# Altium project Final_20230913.PrjPcb
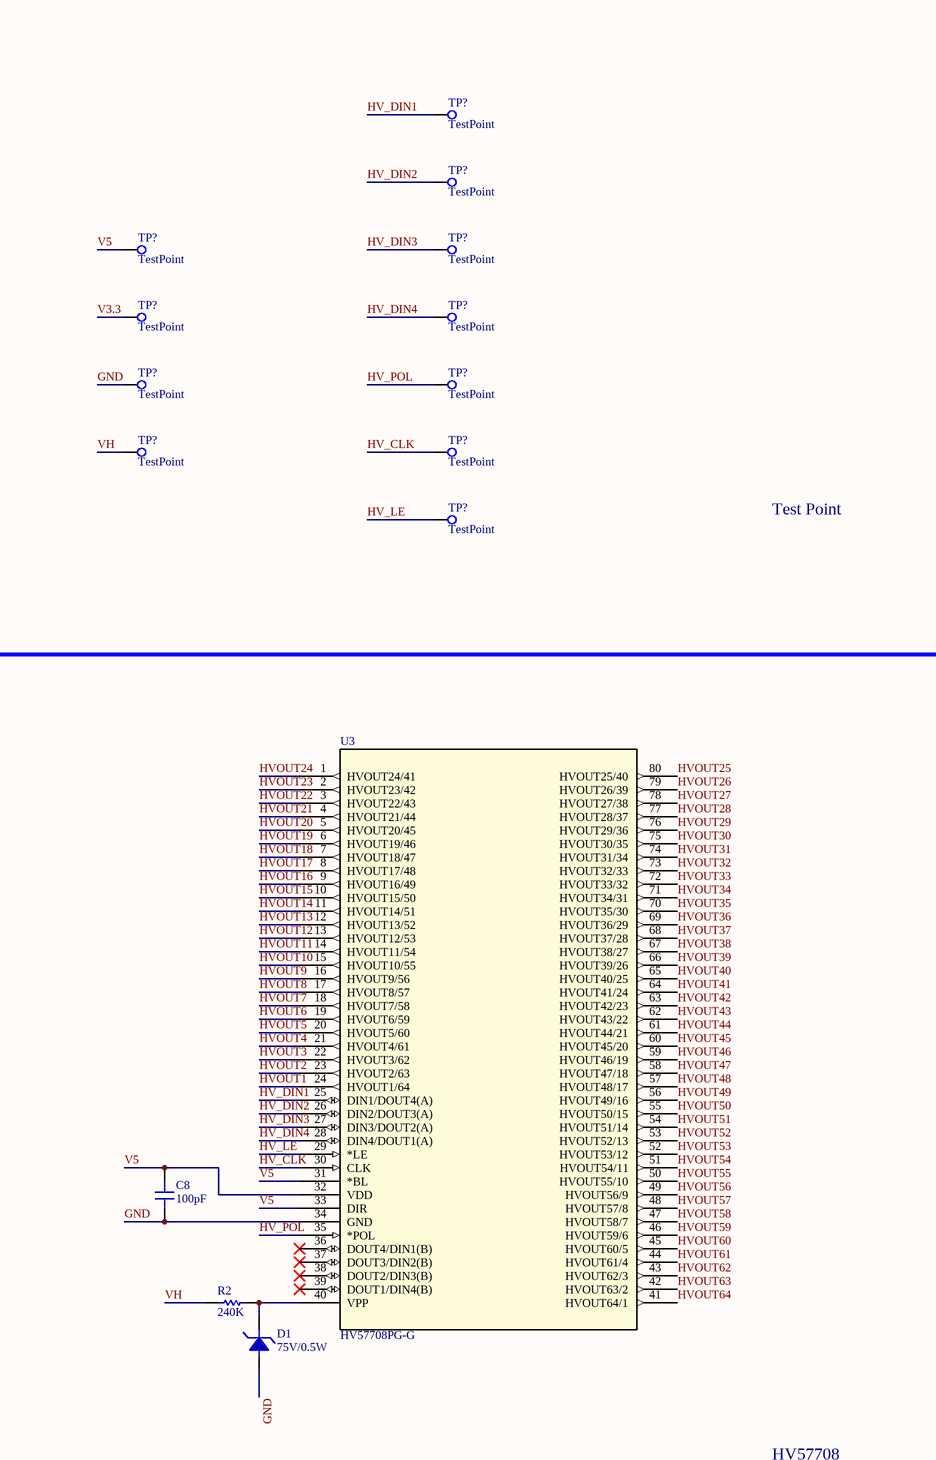
[diagram p0: Sch.SchDoc, top left]
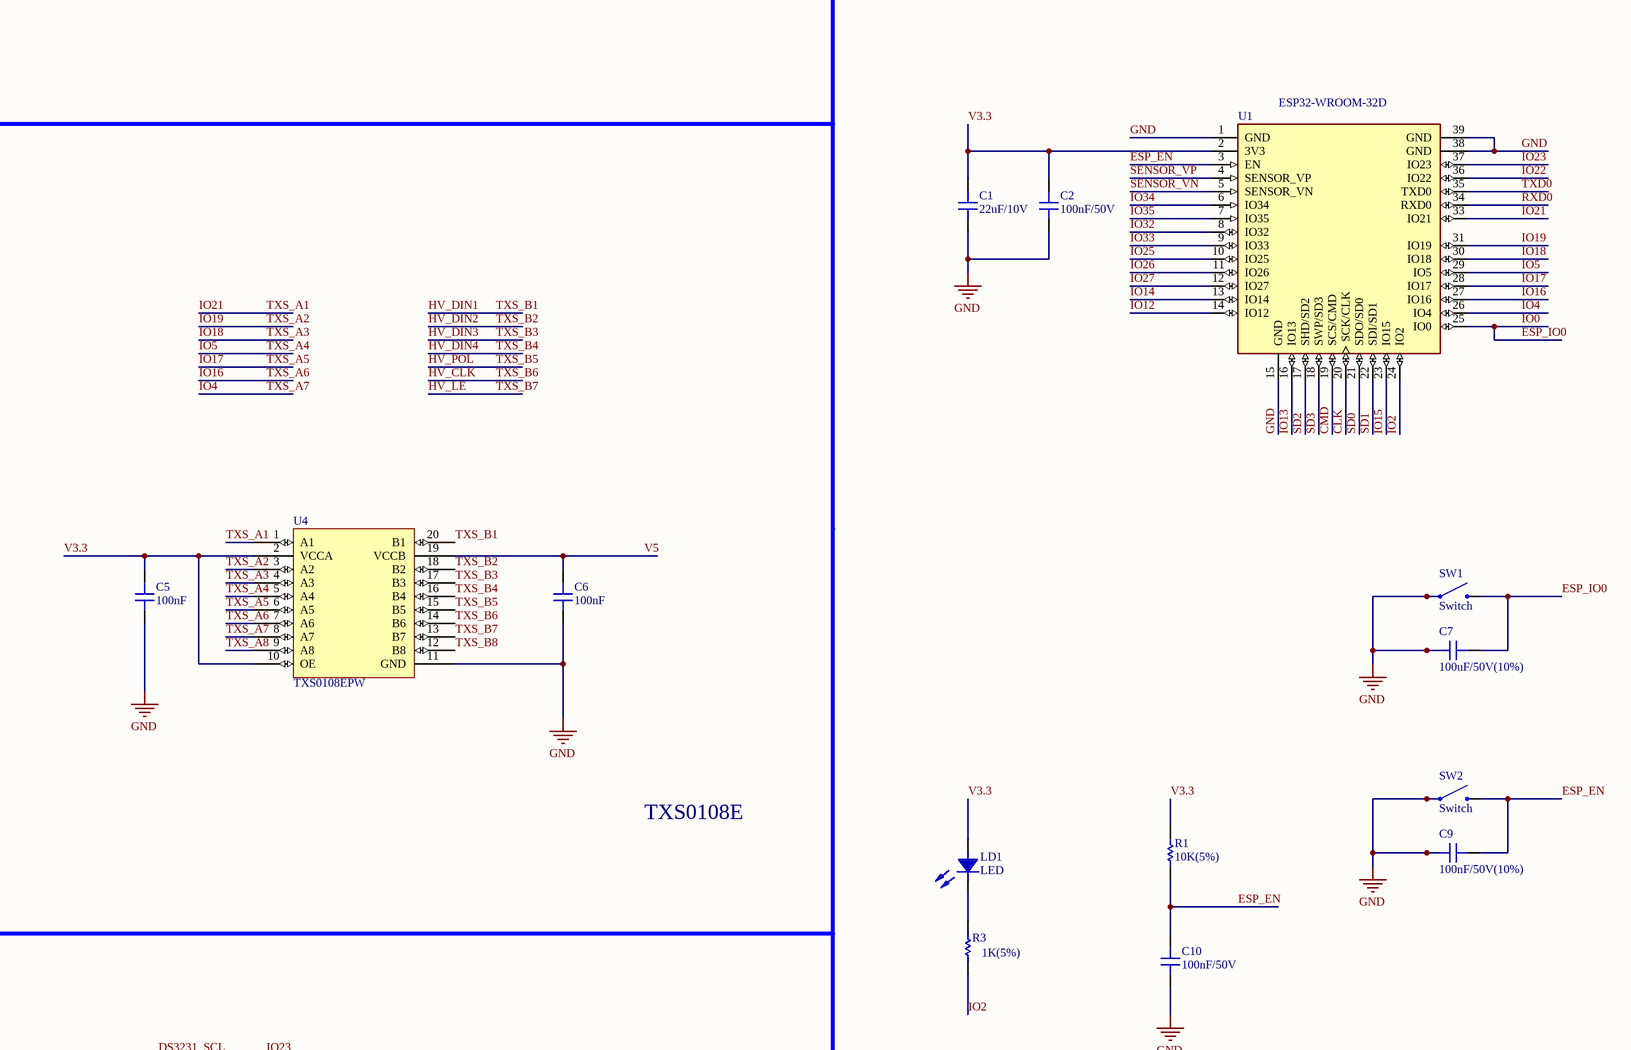
[diagram p1: Sch.SchDoc, top middle]
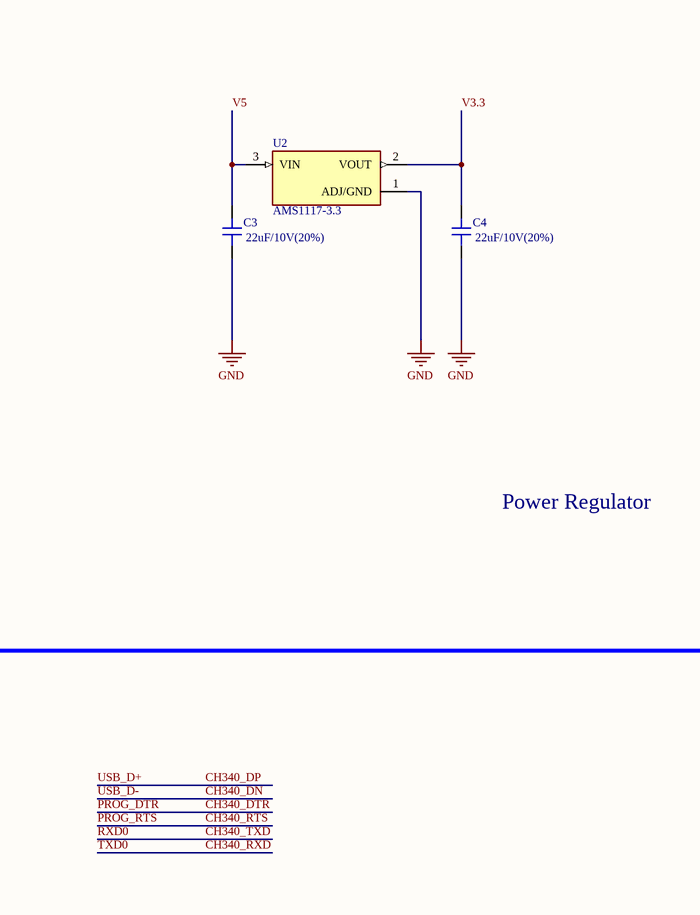
[diagram p2: Sch.SchDoc, top right]
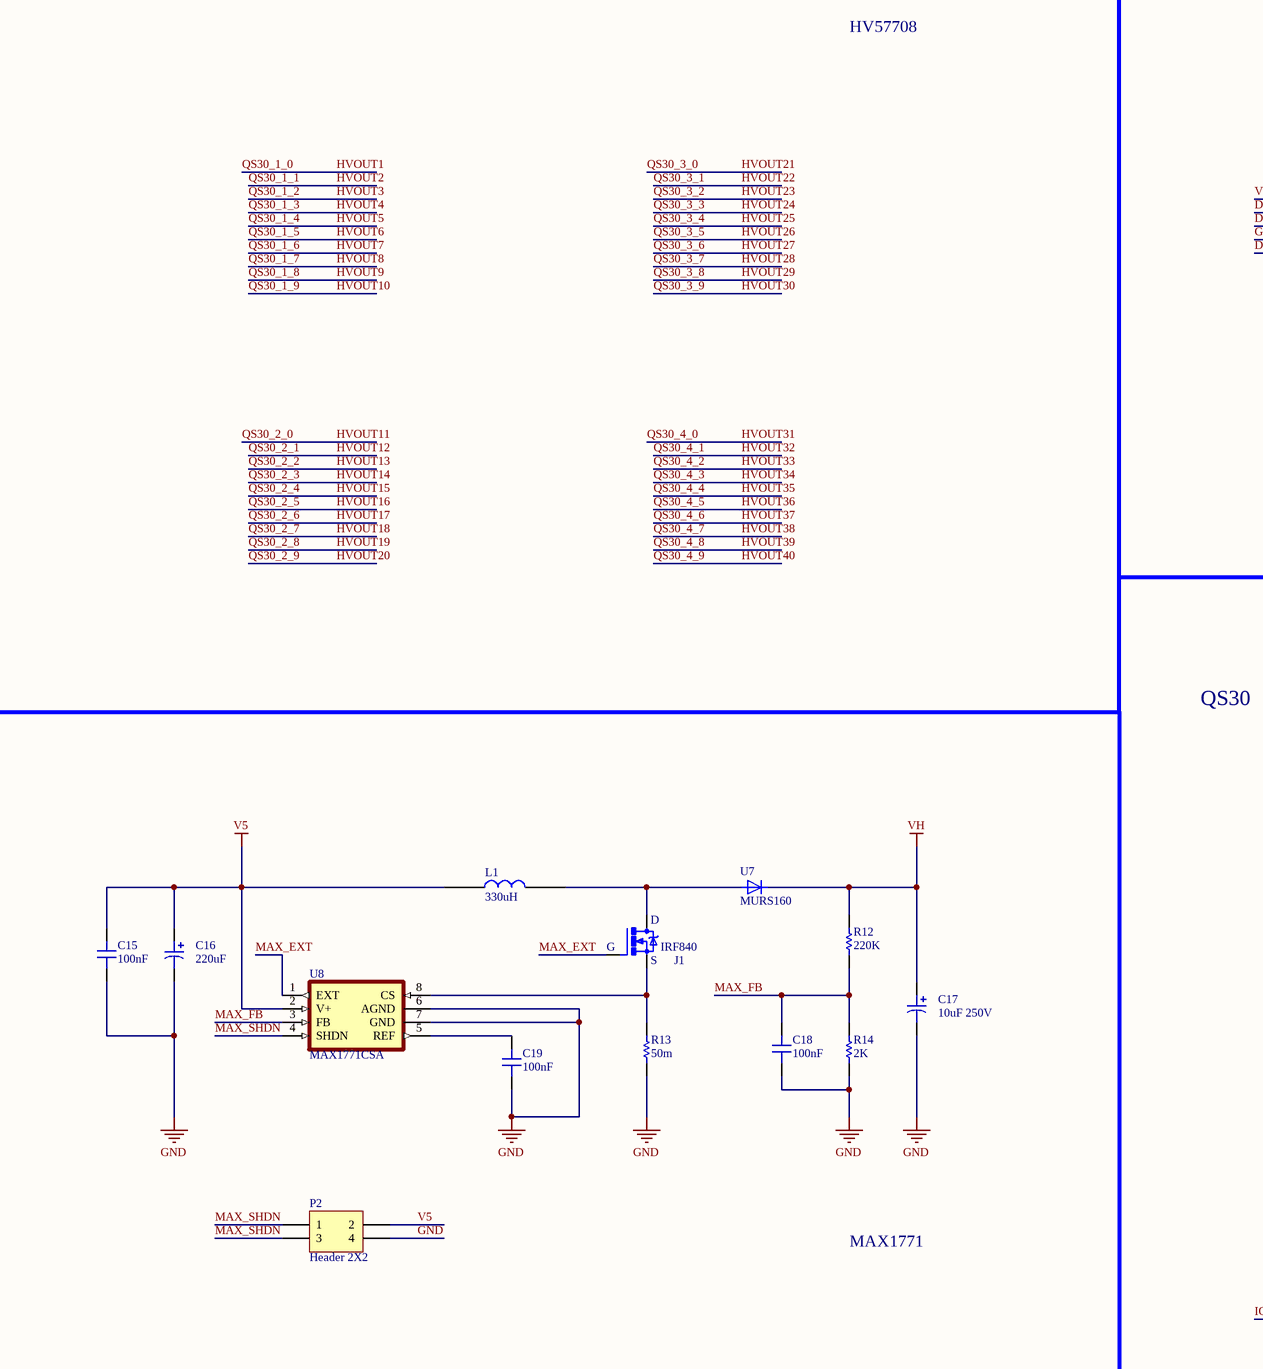
[diagram p3: Sch.SchDoc, bottom left]
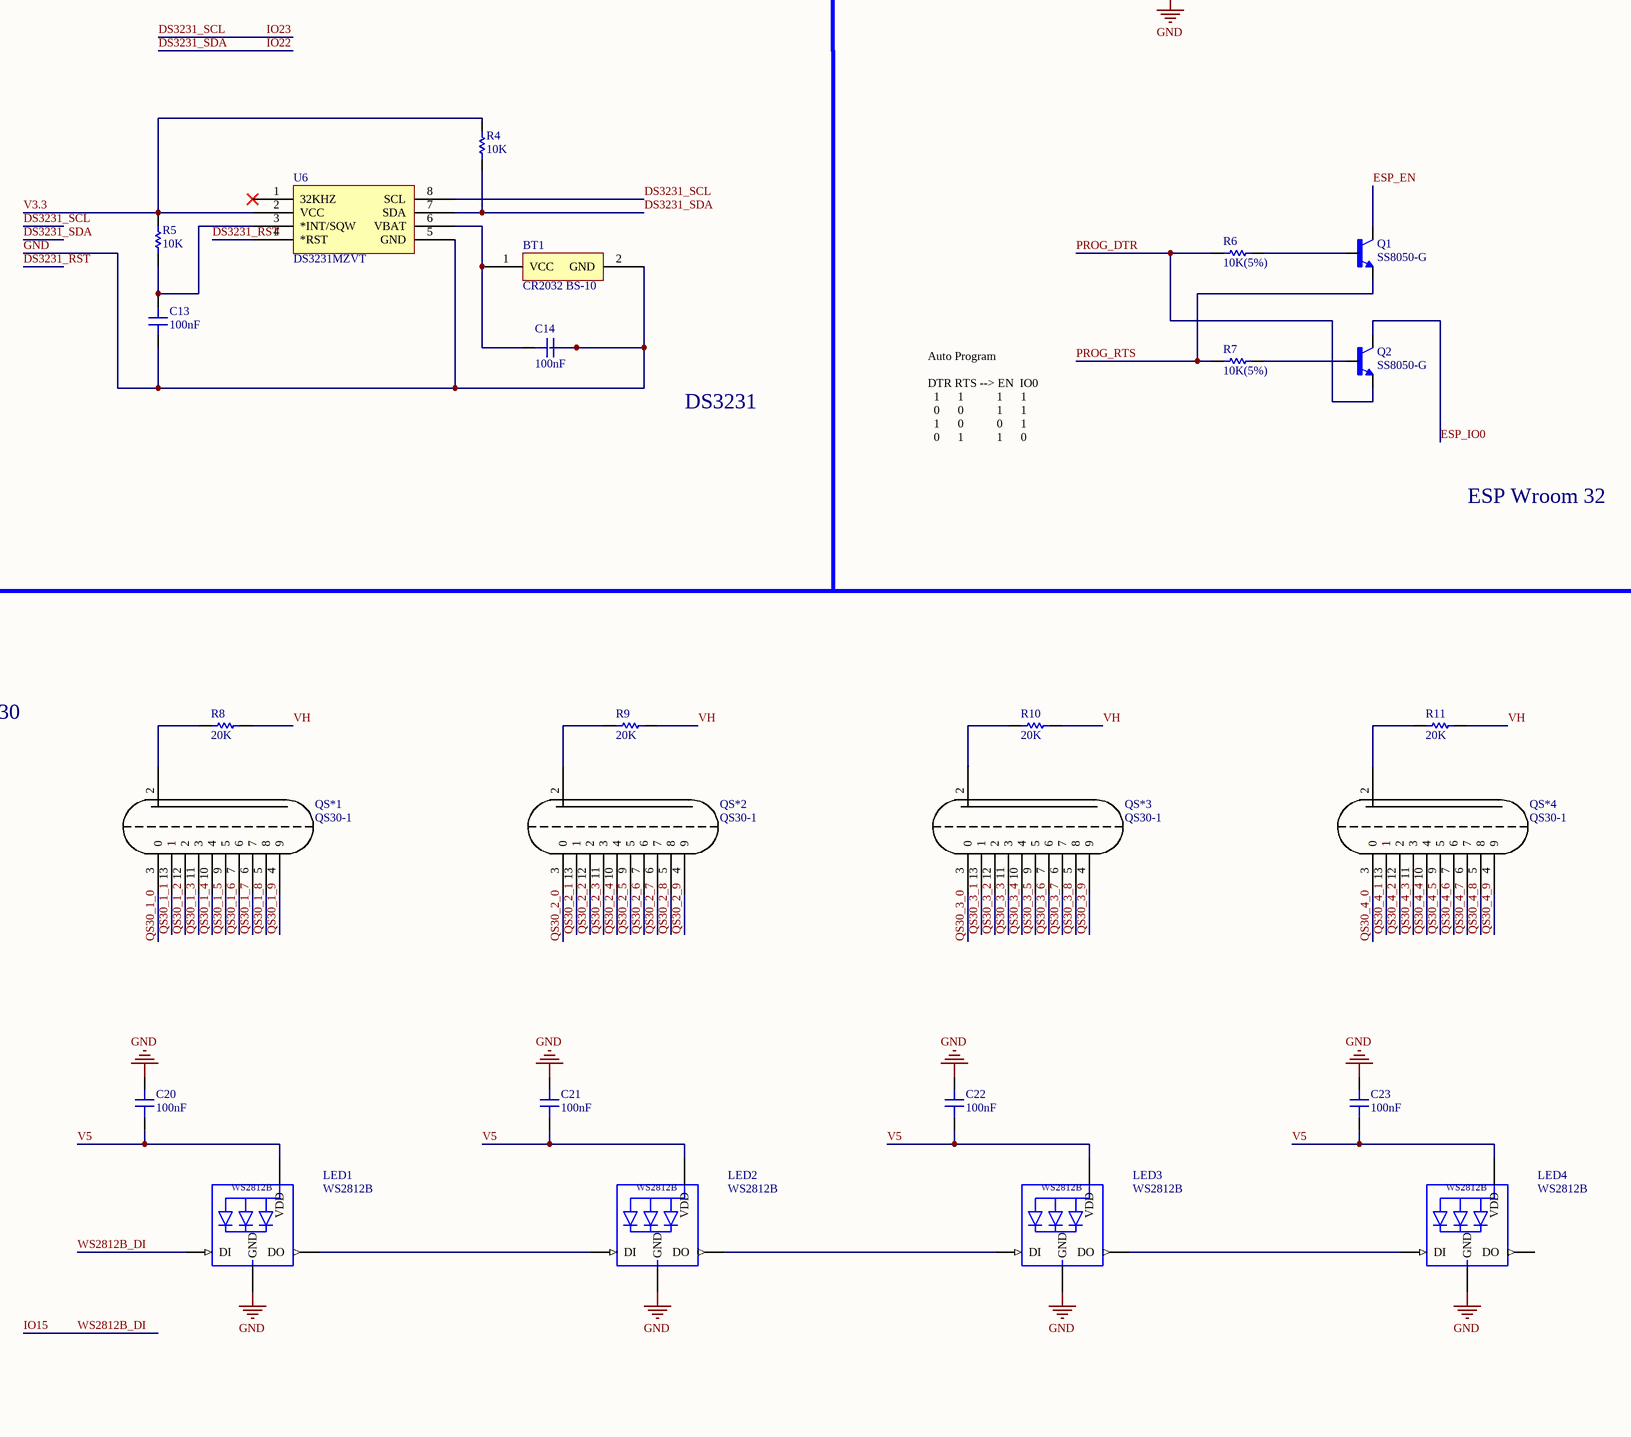
[diagram p4: Sch.SchDoc, bottom middle]
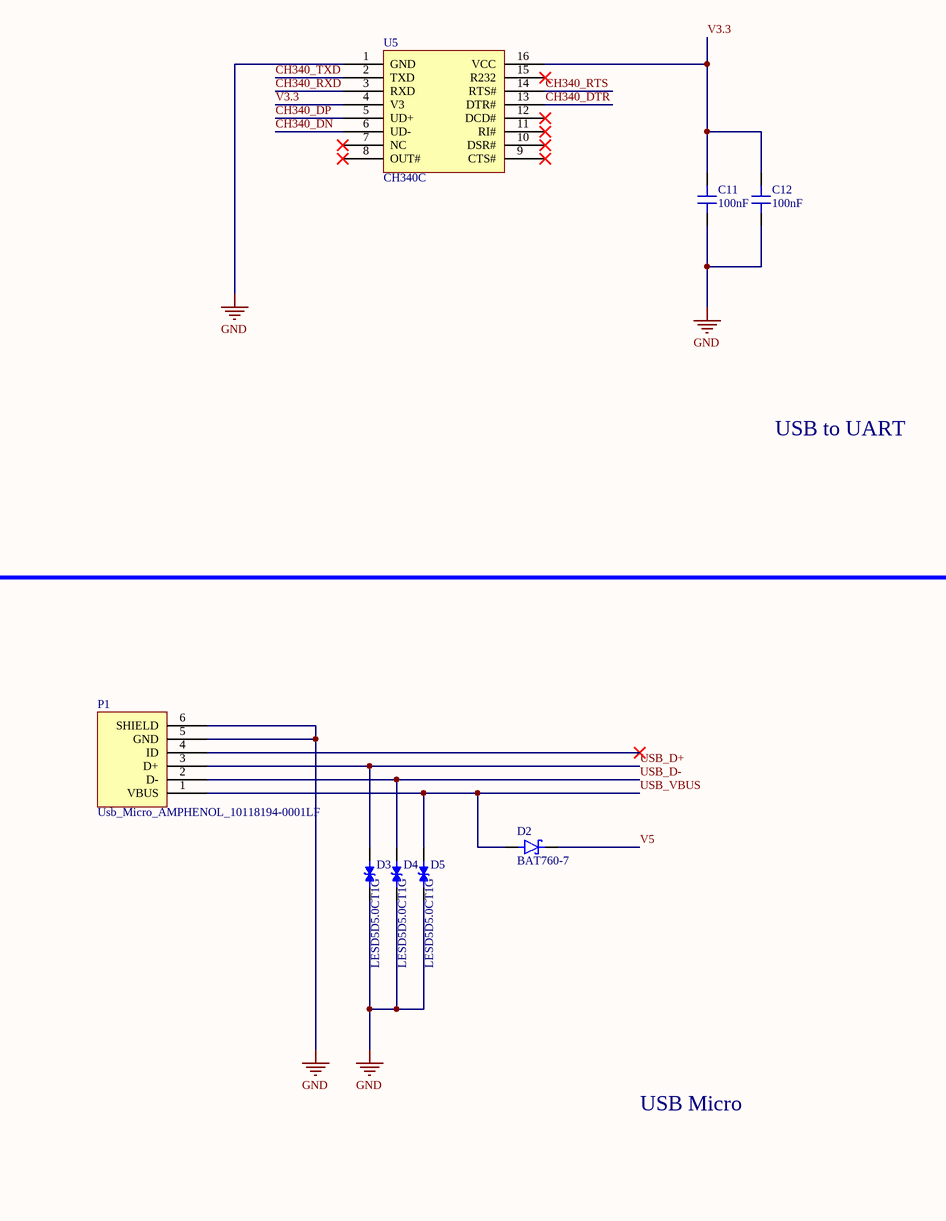
[diagram p5: Sch.SchDoc, bottom right]
1 sheet, 79 parts. Net scope: global (net labels, ports and power ports of the same name join across sheets).
Board file: Pcb.PcbDoc

## Sheet Sch.SchDoc
size A1

### Parts
(Parts that share a designator on the sheet are numbered #1, #2 ... from top to bottom, then left to right.)
BT1  CR2032 BS-10  [CR2032 BS-10]
C1  22uF/10V  [0805]
C2  100nF/50V  [0805]
C3  22uF/10V(20%)  [0805]
C4  22uF/10V(20%)  [0805]
C5  100nF  [0805]
C6  100nF  [0805]
C7  100uF/50V(10%)  [0805]
C8  100pF  [0805]
C9  100nF/50V(10%)  [0805]
C10  100nF/50V  [0805]
C11  100nF  [0805]
C12  100nF  [0805]
C13  100nF  [0805]
C14  100nF  [0805]
C15  100nF  [0805]
C16  220uF  [CAPAE7666X77M_6-3x7-7]
C17  10uF 250V  [CAPAE113103X125M_10x12-5]
C18  100nF  [0805]
C19  100nF  [0805]
C20  100nF  [0805]
C21  100nF  [0805]
C22  100nF  [0805]
C23  100nF  [0805]
D1  75V/0.5W  [1206 Semiconductor]
D2  BAT760-7  [BAT760-7_SOD2513X120N]
D3  LESD5D5.0CT1G  [TVS_LESD5D5.0CT1G]
D4  LESD5D5.0CT1G  [TVS_LESD5D5.0CT1G]
D5  LESD5D5.0CT1G  [TVS_LESD5D5.0CT1G]
J1  IRF840  [TO220V]
L1  330uH  [INDP125125X80N]
LD1  LED  [0805 Semiconductor]
LED1  WS2812B  [WS2812B]
LED2  WS2812B  [WS2812B]
LED3  WS2812B  [WS2812B]
LED4  WS2812B  [WS2812B]
P1  Usb_Micro_AMPHENOL_10118194-0001LF  [USB_MICRO_AMPHENOL_10118194-0001LF]
P2  Header 2X2  [HDR2X2]
Q1  SS8050-G  [TRANS_SS8050-G]
Q2  SS8050-G  [TRANS_SS8050-G]
QS*1  QS30-1  [QS30-1]
QS*2  QS30-1  [QS30-1]
QS*3  QS30-1  [QS30-1]
QS*4  QS30-1  [QS30-1]
R1  10K(5%)  [0805]
R2  240K  [0805]
R3  1K(5%)  [0805]
R4  10K  [0805]
R5  10K  [0805]
R6  10K(5%)  [0805]
R7  10K(5%)  [0805]
R8  20K  [0805]
R9  20K  [0805]
R10  20K  [0805]
R11  20K  [0805]
R12  220K  [0805]
R13  50m  [0805]
R14  2K  [0805]
SW1  Switch  [2917]
SW2  Switch  [2917]
TP?#1  TestPoint  [Test-Point-SMD]
TP?#2  TestPoint  [Test-Point-SMD]
TP?#3  TestPoint  [Test-Point-SMD]
TP?#4  TestPoint  [Test-Point-SMD]
TP?#5  TestPoint  [Test-Point-SMD]
TP?#6  TestPoint  [Test-Point-SMD]
TP?#7  TestPoint  [Test-Point-SMD]
TP?#8  TestPoint  [Test-Point-SMD]
TP?#9  TestPoint  [Test-Point-SMD]
TP?#10  TestPoint  [Test-Point-SMD]
TP?#11  TestPoint  [Test-Point-SMD]
U1  ESP32-WROOM-32D  [ESP32-WROOM-32D]
U2  AMS1117-3.3  [AMS1117_3V3_SOT229P700X180-4N]
U3  HV57708PG-G  [HV57708]
U4  TXS0108EPW  [TXS0108EPW]
U5  CH340C  [CH340C_SOIC127P600X180-16N]
U6  DS3231MZVT  [DS3231]
U7  MURS160  [MURS160]
U8  MAX1771CSA  [MAX1771CSA]

### Nets
GND: BT1.2(GND) C1.1 C2.1 C3.2 C4.2 C5.1 C6.1 C7.1 C8.1 C9.1 C10.1 C11.1 C12.1 C13.1 C14.1 C15.2 C16.2 C17.2 C18.2 C19.2 C20.1 C21.1 C22.1 C23.1 D1.2 D3.1 D4.1 D5.1 LED1.3-GND(GND) LED2.3-GND(GND) LED3.3-GND(GND) LED4.3-GND(GND) P1.5(GND) P1.6(SHIELD) P2.4 R13.2 R14.2 SW1.1 SW2.1 TP?#7.1 U1.1(GND) U1.15(GND) U1.38(GND) U1.39(GND) U2.1(ADJ/GND) U3.34(GND) U4.11(GND) U5.1(GND) U6.5(GND) U8.6(AGND) U8.7(GND)
V5: C3.1 C6.2 C8.2 C15.1 C16.1 C20.2 C21.2 C22.2 C23.2 D2.C(K) L1.1 LED1.1-VDD(VDD) LED2.1-VDD(VDD) LED3.1-VDD(VDD) LED4.1-VDD(VDD) P2.2 TP?#3.1 U2.3(VIN) U3.31(*BL) U3.32(VDD) U3.33(DIR) U4.19(VCCB) U8.2(V+)
VH: C17.1 R2.1 R8.2 R9.2 R10.2 R11.2 R12.1 TP?#9.1 U7.2(C)
CH340_DN: D4.2 P1.2(D-) U5.6(UD-)  [also labelled USB_D-]
CH340_DP: D3.2 P1.3(D+) U5.5(UD+)  [also labelled USB_D+]
CH340_DTR: Q2.2(E) R6.1 U5.13(DTR#)  [also labelled PROG_DTR]
CH340_RTS: Q1.2(E) R7.1 U5.14(RTS#)  [also labelled PROG_RTS]
CH340_RXD: U1.35(TXD0) U5.3(RXD)  [also labelled TXD0]
CH340_TXD: U1.34(RXD0) U5.2(TXD)  [also labelled RXD0]
CLK: U1.20(SCK/CLK)
CMD: U1.19(SCS/CMD)
DS3231_RST: U6.4(*RST)
DS3231_SCL: U1.37(IO23) U6.8(SCL)  [also labelled IO23]
DS3231_SDA: R4.1 U1.36(IO22) U6.7(SDA)  [also labelled IO22]
ESP_EN: C9.2 C10.2 Q1.3(C) R1.2 SW2.2 U1.3(EN)
ESP_IO0: C7.2 Q2.3(C) SW1.2 U1.25(IO0)  [also labelled IO0]
HV_CLK: TP?#10.1 U3.30(CLK) U4.14(B6)  [also labelled TXS_B6]
HV_DIN1: TP?#1.1 U3.25(DIN1/DOUT4(A)) U4.20(B1)  [also labelled TXS_B1]
HV_DIN2: TP?#2.1 U3.26(DIN2/DOUT3(A)) U4.18(B2)  [also labelled TXS_B2]
HV_DIN3: TP?#4.1 U3.27(DIN3/DOUT2(A)) U4.17(B3)  [also labelled TXS_B3]
HV_DIN4: TP?#6.1 U3.28(DIN4/DOUT1(A)) U4.16(B4)  [also labelled TXS_B4]
HV_LE: TP?#11.1 U3.29(*LE) U4.13(B7)  [also labelled TXS_B7]
HV_POL: TP?#8.1 U3.35(*POL) U4.15(B5)  [also labelled TXS_B5]
HVOUT1: QS*1.3(0) U3.24(HVOUT1/64)  [also labelled QS30_1_0]
HVOUT2: QS*1.13(1) U3.23(HVOUT2/63)  [also labelled QS30_1_1]
HVOUT3: QS*1.12(2) U3.22(HVOUT3/62)  [also labelled QS30_1_2]
HVOUT4: QS*1.11(3) U3.21(HVOUT4/61)  [also labelled QS30_1_3]
HVOUT5: QS*1.10(4) U3.20(HVOUT5/60)  [also labelled QS30_1_4]
HVOUT6: QS*1.9(5) U3.19(HVOUT6/59)  [also labelled QS30_1_5]
HVOUT7: QS*1.7(6) U3.18(HVOUT7/58)  [also labelled QS30_1_6]
HVOUT8: QS*1.6(7) U3.17(HVOUT8/57)  [also labelled QS30_1_7]
HVOUT9: QS*1.5(8) U3.16(HVOUT9/56)  [also labelled QS30_1_8]
HVOUT10: QS*1.4(9) U3.15(HVOUT10/55)  [also labelled QS30_1_9]
HVOUT11: QS*2.3(0) U3.14(HVOUT11/54)  [also labelled QS30_2_0]
HVOUT12: QS*2.13(1) U3.13(HVOUT12/53)  [also labelled QS30_2_1]
HVOUT13: QS*2.12(2) U3.12(HVOUT13/52)  [also labelled QS30_2_2]
HVOUT14: QS*2.11(3) U3.11(HVOUT14/51)  [also labelled QS30_2_3]
HVOUT15: QS*2.10(4) U3.10(HVOUT15/50)  [also labelled QS30_2_4]
HVOUT16: QS*2.9(5) U3.9(HVOUT16/49)  [also labelled QS30_2_5]
HVOUT17: QS*2.7(6) U3.8(HVOUT17/48)  [also labelled QS30_2_6]
HVOUT18: QS*2.6(7) U3.7(HVOUT18/47)  [also labelled QS30_2_7]
HVOUT19: QS*2.5(8) U3.6(HVOUT19/46)  [also labelled QS30_2_8]
HVOUT20: QS*2.4(9) U3.5(HVOUT20/45)  [also labelled QS30_2_9]
HVOUT21: QS*3.3(0) U3.4(HVOUT21/44)  [also labelled QS30_3_0]
HVOUT22: QS*3.13(1) U3.3(HVOUT22/43)  [also labelled QS30_3_1]
HVOUT23: QS*3.12(2) U3.2(HVOUT23/42)  [also labelled QS30_3_2]
HVOUT24: QS*3.11(3) U3.1(HVOUT24/41)  [also labelled QS30_3_3]
HVOUT25: QS*3.10(4) U3.80(HVOUT25/40)  [also labelled QS30_3_4]
HVOUT26: QS*3.9(5) U3.79(HVOUT26/39)  [also labelled QS30_3_5]
HVOUT27: QS*3.7(6) U3.78(HVOUT27/38)  [also labelled QS30_3_6]
HVOUT28: QS*3.6(7) U3.77(HVOUT28/37)  [also labelled QS30_3_7]
HVOUT29: QS*3.5(8) U3.76(HVOUT29/36)  [also labelled QS30_3_8]
HVOUT30: QS*3.4(9) U3.75(HVOUT30/35)  [also labelled QS30_3_9]
HVOUT31: QS*4.3(0) U3.74(HVOUT31/34)  [also labelled QS30_4_0]
HVOUT32: QS*4.13(1) U3.73(HVOUT32/33)  [also labelled QS30_4_1]
HVOUT33: QS*4.12(2) U3.72(HVOUT33/32)  [also labelled QS30_4_2]
HVOUT34: QS*4.11(3) U3.71(HVOUT34/31)  [also labelled QS30_4_3]
HVOUT35: QS*4.10(4) U3.70(HVOUT35/30)  [also labelled QS30_4_4]
HVOUT36: QS*4.9(5) U3.69(HVOUT36/29)  [also labelled QS30_4_5]
HVOUT37: QS*4.7(6) U3.68(HVOUT37/28)  [also labelled QS30_4_6]
HVOUT38: QS*4.6(7) U3.67(HVOUT38/27)  [also labelled QS30_4_7]
HVOUT39: QS*4.5(8) U3.66(HVOUT39/26)  [also labelled QS30_4_8]
HVOUT40: QS*4.4(9) U3.65(HVOUT40/25)  [also labelled QS30_4_9]
HVOUT41: U3.64(HVOUT41/24)
HVOUT42: U3.63(HVOUT42/23)
HVOUT43: U3.62(HVOUT43/22)
HVOUT44: U3.61(HVOUT44/21)
HVOUT45: U3.60(HVOUT45/20)
HVOUT46: U3.59(HVOUT46/19)
HVOUT47: U3.58(HVOUT47/18)
HVOUT48: U3.57(HVOUT48/17)
HVOUT49: U3.56(HVOUT49/16)
HVOUT50: U3.55(HVOUT50/15)
HVOUT51: U3.54(HVOUT51/14)
HVOUT52: U3.53(HVOUT52/13)
HVOUT53: U3.52(HVOUT53/12)
HVOUT54: U3.51(HVOUT54/11)
HVOUT55: U3.50(HVOUT55/10)
HVOUT56: U3.49(HVOUT56/9)
HVOUT57: U3.48(HVOUT57/8)
HVOUT58: U3.47(HVOUT58/7)
HVOUT59: U3.46(HVOUT59/6)
HVOUT60: U3.45(HVOUT60/5)
HVOUT61: U3.44(HVOUT61/4)
HVOUT62: U3.43(HVOUT62/3)
HVOUT63: U3.42(HVOUT63/2)
HVOUT64: U3.41(HVOUT64/1)
IO2: R3.1 U1.24(IO2)
IO4: U1.26(IO4) U4.8(A7)  [also labelled TXS_A7]
IO5: U1.29(IO5) U4.5(A4)  [also labelled TXS_A4]
IO12: U1.14(IO12)
IO13: U1.16(IO13)
IO14: U1.13(IO14)
IO15: LED1.4-DIN(DI) U1.23(IO15)  [also labelled WS2812B_DI]
IO16: U1.27(IO16) U4.7(A6)  [also labelled TXS_A6]
IO17: U1.28(IO17) U4.6(A5)  [also labelled TXS_A5]
IO18: U1.30(IO18) U4.4(A3)  [also labelled TXS_A3]
IO19: U1.31(IO19) U4.3(A2)  [also labelled TXS_A2]
IO21: U1.33(IO21) U4.1(A1)  [also labelled TXS_A1]
IO25: U1.10(IO25)
IO26: U1.11(IO26)
IO27: U1.12(IO27)
IO32: U1.8(IO32)
IO33: U1.9(IO33)
IO34: U1.6(IO34)
IO35: U1.7(IO35)
MAX_EXT: J1.1(G) U8.1(EXT)
MAX_FB: C18.1 R12.2 R14.1 U8.3(FB)
MAX_SHDN: P2.1 P2.3 U8.4(SHDN)
SD0: U1.21(SDO/SD0)
SD1: U1.22(SDI/SD1)
SD2: U1.17(SHD/SD2)
SD3: U1.18(SWP/SD3)
SENSOR_VN: U1.5(SENSOR_VN)
SENSOR_VP: U1.4(SENSOR_VP)
TXS_A8: U4.9(A8)
TXS_B8: U4.12(B8)
USB_VBUS: D2.A D5.2 P1.1(VBUS)
V3.3: C1.2 C2.2 C4.1 C5.2 C11.2 C12.2 LD1.2 R1.1 R4.2 R5.2 TP?#5.1 U1.2(3V3) U2.2(VOUT) U4.2(VCCA) U4.10(OE) U5.4(V3) U5.16(VCC) U6.2(VCC)
NetBT1_1: BT1.1(VCC) C14.2 U6.6(VBAT)
NetC13_2: C13.2 R5.1 U6.3(*INT/SQW)
NetC19_1: C19.1 U8.5(REF)
NetD1_1: D1.1 R2.2 U3.40(VPP)
NetJ1_2: J1.2(D) L1.2 U7.1(A)
NetJ1_3: J1.3(S) R13.1 U8.8(CS)
NetLD1_1: LD1.1 R3.2
NetLED1_2-DOUT: LED1.2-DOUT(DO) LED2.4-DIN(DI)
NetLED2_2-DOUT: LED2.2-DOUT(DO) LED3.4-DIN(DI)
NetLED3_2-DOUT: LED3.2-DOUT(DO) LED4.4-DIN(DI)
NetQ1_1: Q1.1(B) R6.2
NetQ2_1: Q2.1(B) R7.2
NetQS*1_2: QS*1.2 R8.1
NetQS*2_2: QS*2.2 R9.1
NetQS*3_2: QS*3.2 R10.1
NetQS*4_2: QS*4.2 R11.1

Not connected (* = marked no-connect by the designer): LED4 2-DOUT(DO); P1 4(ID)*; U3 36(DOUT4/DIN1(B))* 37(DOUT3/DIN2(B))* 38(DOUT2/DIN3(B))* 39(DOUT1/DIN4(B))*; U5 7(NC)* 8(OUT#)* 9(CTS#)* 10(DSR#)* 11(RI#)* 12(DCD#)* 15(R232)*; U6 1(32KHZ)*

### Notes on the sheet
- Test Point
- Power Regulator
- TXS0108E
- HV57708
- DS3231
- Auto Program
  DTR RTS --> EN  IO0
  1      1           1      1
  0      0           1      1
  1      0           0      1
  0      1           1      0
- USB to UART
- ESP Wroom 32
- QS30
- USB Micro
- MAX1771

### Library data of the parts
C1-C15 C18-C23 = Capacitor
C16 C17 = CapacitorPolarized
D1 = DiodeZener
D2 = BAT760-7: Diode Schottky 30V 1A 2-Pin SOD-323 T/R; MF: Diodes Zetex; MP: BAT760-7; SnapEDA_Link: https://www.snapeda.com/parts/BAT760-7/Zetex/view-part/4817231/?ref=snap; Value: *; DigiKey-Purchase-URL: https://snapeda.com/shop?store=DigiKey&id=4817231; Package: None; Mouser-Purchase-URL: https://snapeda.com/shop?store=Mouser&id=4817231; Price: None; Availability: Good
D3-D5 = LESD5D5.0CT1G: Transient Voltage Suppressors for ESD Protection; MF: Leshan Radio Co.; Value: *; SnapEDA_Link: https://www.snapeda.com/parts/LESD5D5.0CT1G/Leshan+Radio+Co./view-part/?ref=snap; MP: LESD5D5.0CT1G; Check_prices: https://www.snapeda.com/parts/LESD5D5.0CT1G/Leshan+Radio+Co./view-part/?ref=eda; Availability: Not in stock; Price: None; Package: None
J1 = IRF840: N-Channel 500 V 8A (Tc) 3.1W (Tc) Through Hole TO-220FP; MF: STMicroelectronics; MP: IRF630; Check_prices: https://www.snapeda.com/parts/IRF630/STMicroelectronics/view-part/?ref=eda; Purchase-URL: https://pricing.snapeda.com/search/part/IRF630/?ref=eda; Price: None; SnapEDA_Link: https://www.snapeda.com/parts/IRF630/STMicroelectronics/view-part/?ref=snap; Availability: In Stock; Package: TO-220 Vishay; Value: *
L1 = Inductor
LED1-LED4 = WS2812B: Raspberry Pi HAT _40 pin_ Wheeled Robotics Kit; MF: SparkFun Electronics; Availability: Unavailable; SnapEDA_Link: https://www.snapeda.com/parts/WS2812B/Worldsemi/view-part/1038297/?ref=snap; MP: WS2812B; Price: None; Value: *; Package: None
P1 = Usb_Micro
P2 = Header 2X2: Header, 2-Pin, Dual row; LatestRevisionDate: 17-Jul-2002; LatestRevisionNote: Re-released for DXP Platform.; Publisher: Altium Limited
Q1 Q2 = SS8050-G: Bipolar (BJT) Transistor NPN 25 V 1.5 A 100MHz 300 mW Surface Mount SOT-23-3; MF: Comchip Technology; SnapEDA_Link: https://www.snapeda.com/parts/SS8050-G/Comchip+Technology/view-part/?ref=snap; Purchase-URL: https://pricing.snapeda.com/search/part/SS8050-G/?ref=eda; Availability: In Stock; Price: None; Package: TO-236-3 Comchip Technology; Check_prices: https://www.snapeda.com/parts/SS8050-G/Comchip+Technology/view-part/?ref=eda; Value: *; MP: SS8050-G
R1-R14 = Resistor
SW1 SW2 = Switch: Resistor
U1 = ESP32-WROOM-32D: Bluetooth, WiFi 802.11b/g/n, Bluetooth v4.2 + EDR, Class 1, 2 and 3 Transceiver Module 2.4GHz ~ 2.5GHz Integrated, Trace Surface Mount; MF: Espressif Systems; Price: None; Package: Module Espressif Systems; Availability: Unavailable; SnapEDA_Link: https://www.snapeda.com/parts/ESP32-WROOM-32D/Espressif%20Systems/view-part/2768115/?ref=snap; Value: *; MP: ESP32-WROOM-32D
U2 = AMS1117-3.3: Sot223/Pkg 1-Amp 3.3-Volt Low Drop Out Voltage Regulatator; MF: Advanced Monolithic Systems; Price: None; Package: None; Value: *; MP: AMS1117-3.3; Availability: Unavailable; SnapEDA_Link: https://www.snapeda.com/parts/AMS1117-3.3/Advanced%20Monolithic%20Systems/view-part/53450/?ref=snap
U3 = HV57708PG-G: No Description Available; Mfr_Name: Microchip; RefDes: RefDes; Type: Type
U6 = DS3231MZVT: Real Time Clock _RTC_ IC Clock/Calendar IÂ²C, 2-Wire Serial 8-SOIC _0.154, 3.90mm Width_; MF: Maxim Integrated; MP: DS3231MZ/V+T; Digi-Key_Part_Number: DS3231MZ/V+TTR-ND; Digi-Key_Purchase_URL: https://www.digikey.com/product-detail/en/maxim-integrated/DS3231MZ-V-T/DS3231MZ-V-TTR-ND/3440500?utm_source=snapeda&utm_medium=aggregator&utm_campaign=symbol; SnapEDA_Link: https://www.snapeda.com/parts/DS3231MZ/V+T/Maxim%20Integrated/view-part/230018/?ref=snap; Package: SOIC-8 Maxim Integrated; Value: *
U7 = MURS160: Diode Standard 600V 1A Surface Mount SMB; MF: World Products; MP: MURS160; Availability: Unavailable; SnapEDA_Link: https://www.snapeda.com/parts/MURS160/World%20Products/view-part/564901/?ref=snap; Package: DO-214AA-214 World Products; Price: None; Value: *
U8 = MAX1771CSA: Boost, Buck-Boost Regulator Positive Output Step-Up, Step-Up/Step-Down - DC-DC Controller IC 8-SOIC; MF: Maxim Integrated; Price: None; MP: MAX1771CSA; Purchase-URL: https://pricing.snapeda.com/search/part/MAX1771CSA/?ref=eda; Package: SOIC-8 Maxim; Check_prices: https://www.snapeda.com/parts/MAX1771CSA/Maxim+Integrated/view-part/?ref=eda; SnapEDA_Link: https://www.snapeda.com/parts/MAX1771CSA/Maxim+Integrated/view-part/?ref=snap; Availability: In Stock; Value: *